# EAGLE design BatmanDetector (EAGLE 7.5.0)
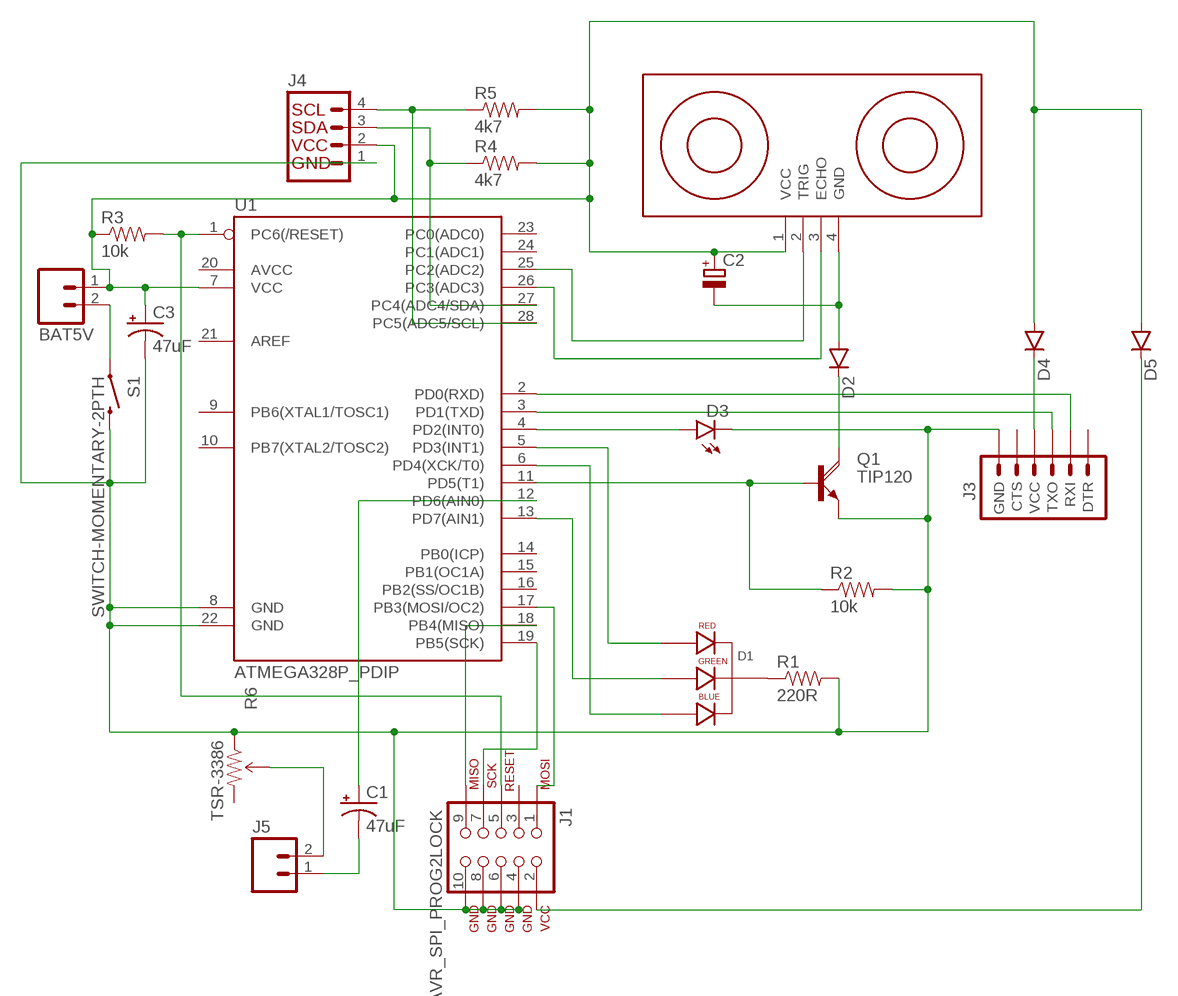
[diagram p0: schematic, sheet 1]

## Parts
BAT5V  M02JST-PTH-VERT  [JST-2-PTH-VERT]
C1  47uF  CAP_POLPTH2  [CPOL-RADIAL-10UF-25V]
C2  CPOL-EUE15-5AXIAL  [E15-5]
C3  47uF  CAP_POLPTH2  [CPOL-RADIAL-10UF-25V]
D1  LED-RGB-CC-THRUDIFFUSE  [LED-RGB-THRU]
D2  DIODE1N4148  [DIODE-1N4148]
D3  LED-3MM-NO_SILK  [LED3MM-NS]
D4  DIODE1N4148  [DIODE-1N4148]
D5  DIODE1N4148  [DIODE-1N4148]
J1  AVR_SPI_PROG2LOCK  [2X5-SHROUDED_LOCK]
J3  ARDUINO_SERIAL_PROGRAMLONGPADS  [1X06_LONGPADS]
J4  I2C_STANDARD_NO_SILK  [1X04_NO_SILK]
J5  M02PTH3  [1X02_LONGPADS]
Q1  TIP120  [TO220AH]
R1  220R  RESISTORAXIAL-0.3  [AXIAL-0.3]
R2  10k  RESISTORAXIAL-0.3  [AXIAL-0.3]
R3  10k  RESISTORAXIAL-0.3  [AXIAL-0.3]
R4  4k7  RESISTORAXIAL-0.3  [AXIAL-0.3]
R5  4k7  RESISTORAXIAL-0.3  [AXIAL-0.3]
R6  TSR-3386  TRIMPOT-PTH-KNOB  [3386U]
S1  SWITCH-MOMENTARY-2PTH  [TACTILE-PTH]
U1  ATMEGA328P_PDIP  [DIL28-3]
U$1  ULTRASONIC-HC-SR04#V  [ULTRASONIC-HC-SR04#V]

## Nets
N$1: D1.1(RED_CATHODE) U1.5(PD3(INT1))
N$2: J1.1(MOSI) U1.17(PB3(MOSI/OC2))
N$3: J1.7(SCK) U1.19(PB5(SCK))
N$4: J3.2(RXI) U1.2(PD0(RXD))
N$5: J3.3(TXO) U1.3(PD1(TXD))
N$6: D3.A U1.4(PD2(INT0))
N$7: Q1.B R2.P$1 U1.11(PD5(T1))
N$8: C2.- D2.A U$1.4(GND)
N$9: D2.C Q1.C
N$10: D1.4(BLUE_CATHODE) U1.6(PD4(XCK/T0))
N$11: D1.3(GREEN_CATHODE) U1.13(PD7(AIN1))
N$12: D1.2(CATHODE) R1.P$1
N$13: U1.25(PC2(ADC2)) U$1.2(TRIG)
N$14: J5.2 R6.2(WIPER)
N$15: J1.5(RESET) R3.P$2 U1.1(PC6(/RESET))
N$16: J4.3 R4.P$1 U1.27(PC4(ADC4/SDA))
N$17: U1.26(PC3(ADC3)) U$1.3(ECHO)
N$19: J4.4 R5.P$1 U1.28(PC5(ADC5/SCL))
N$20: D4.C J3.4(VCC)
N$21: D5.C J1.2(VCC)
N$22: C1.2(-) J5.1
N$23: C1.1(+) U1.12(PD6(AIN0))
N$24: J1.9(MISO) U1.18(PB4(MISO))
N$25: C3.2(-) D3.K(C) J1.4(GND) J1.6(GND) J1.8(GND) J1.10(GND) J3.6(GND) J4.1 Q1.E R1.P$2 R2.P$2 R6.1(CCW) S1.3 U1.8(GND) U1.22(GND)
N$26: BAT5V.2 S1.1
N$27: BAT5V.1 C2.+ C3.1(+) D4.A D5.A J4.2 R3.P$1 R4.P$2 R5.P$2 U1.7(VCC) U$1.1(VCC)
Unconnected: J1.3(NC) J3.1(DTR) J3.5(CTS) R6.3(CW) U1.9(PB6(XTAL1/TOSC1)) U1.10(PB7(XTAL2/TOSC2)) U1.14(PB0(ICP)) U1.15(PB1(OC1A)) U1.16(PB2(SS/OC1B)) U1.20(AVCC) U1.21(AREF) U1.23(PC0(ADC0)) U1.24(PC1(ADC1))

## Library data of the parts
BAT5V J5 = SparkFun-Connectors:M02: Standard 2-pin 0.1" header. Use with - straight break away headers ( PRT-00116) - right angle break away headers (PRT-00553) - swiss pins (PRT-00743) - machine pins (PRT-00117) - female headers (PRT-00115) Molex polarized connector foot print use with: PRT-08233 with associated crimp pins and housings. 2.54_SCREWTERM for use with PRT-10571. 3.5mm Screw Terminal footprints for PRT-08084 5mm Screw Terminal footprints for use with PRT-08432
C1 C3 = SparkFun-Passives:CAP_POL: Capacitor Polarized These are standard SMD and PTH capacitors. Normally 10uF, 47uF, and 100uF in electrolytic and tantalum varieties. Always verify the external diameter of the through hole cap, it varies with capacity, voltage, and manufacturer. The EIA devices should be standard.
C2 = rcl:CPOL-EU: POLARIZED CAPACITOR, European symbol
D1 = SparkFun-LED:LED-RGB-CC-THRU: RGB Through-hole common cathode LED SparkFun Storefront: COM-00105 (Clear) COM-09264 (Diffuse); PROD_ID: DIO-09434
D2 D4 D5 = SparkFun-DiscreteSemi:DIODE: Diode These are standard reverse protection diodes and small signal diodes. SMA package can handle up to about 1A. SOD-323 can handle about 200mA. What the SOD-323 package when ordering, there are some mfgs out there that are 5-pin packages.
D3 = SparkFun-LED:LED: LEDs Standard schematic elements and footprints for 5mm, 3mm, 1206, and 0603 sized LEDs. 5mm - Spark Fun Electronics SKU : COM-00529 (and others)
J1 = SparkFun-Connectors:AVR_SPI_PROG2: AVR 10-pin ICSP Header This is the standard AVR In Circuit Serial Programming header. Minimal, but includes pin one indicator. Works with standard Olimex programmers. Also look for the 6-pin reduced version. Spark Fun Electronics SKU: PRT-00778
J3 = SparkFun-Connectors:ARDUINO_SERIAL_PROGRAM: FTDI connector footprints
J4 = SparkFun-Connectors:I2C_STANDARD: SparkFun has standardized on a pinout for all I2C based sensor breakouts. This pinout allows I2C boards to be plugged directly into the headers on Arduino Uno compatible boards, and to be daisy chained easily.
Q1 = transistor-power:TIP120: NPN DARLINGTON TRANSISTOR
R1-R5 = SparkFun-Passives:RESISTOR: Resistor Basic schematic elements and footprints for 0603, 1206, and PTH resistors.
R6 = SparkFun-Electromechanical:TRIMPOT: Various small potentiometers for "set-and-forget" applications; PROD_ID: RES-09730
S1 = SparkFun-Electromechanical:SWITCH-MOMENTARY-2: Various NO switches- pushbuttons, reed, etc; PROD_ID: SWCH-08441
U1 = SparkFun-DigitalIC:ATMEGA328P_PDIP: uC used in the Arduino 32kb flash, 1k EEPROM, 2k SRAM This is the through-hole version of this chip.
U$1 = diy-modules:ULTRASONIC-HC-SR04: Ultrasonic Ranging Module HC-SR04

## Board
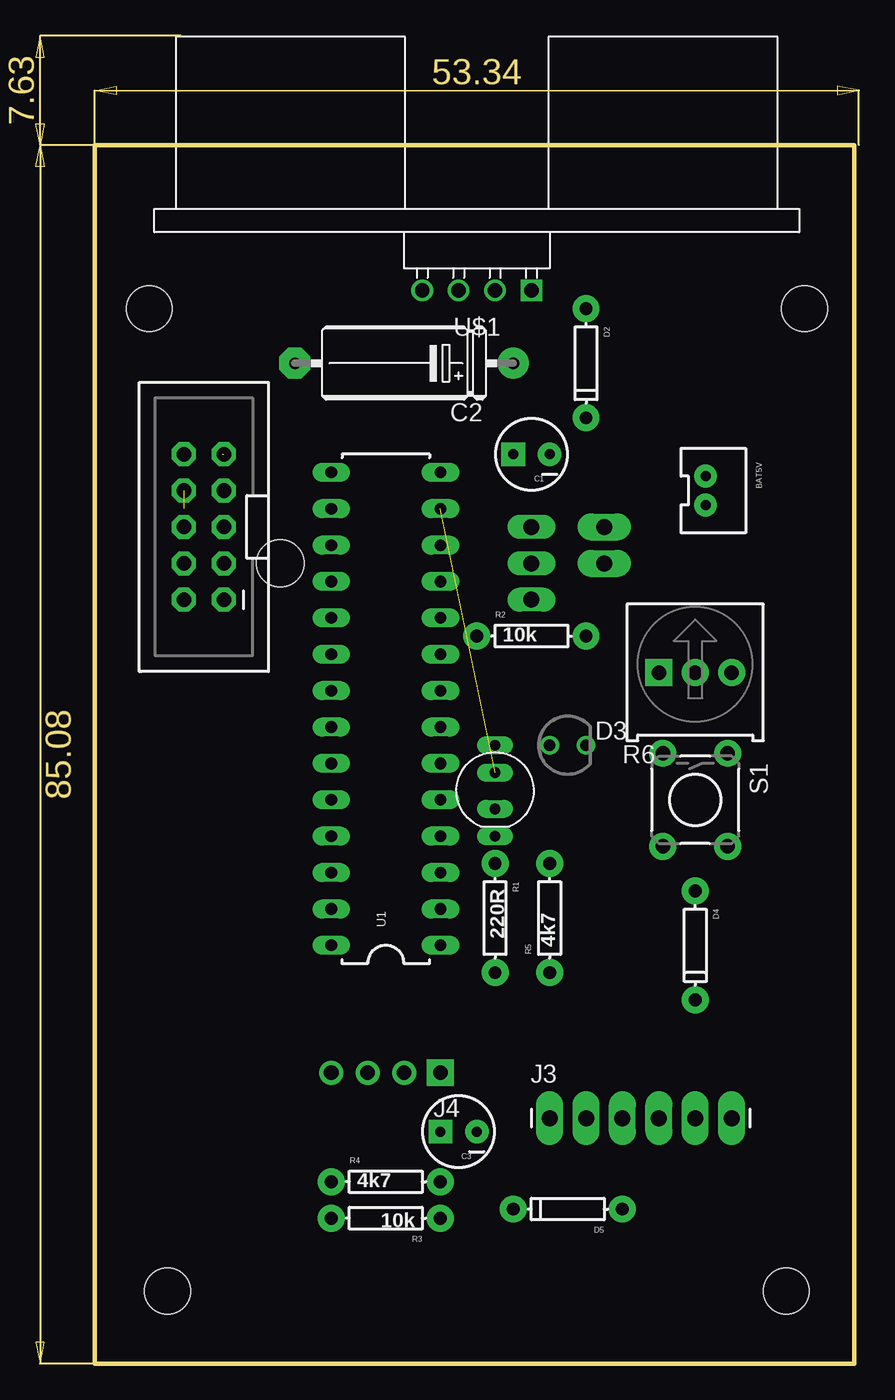
[diagram p1: board, top side]
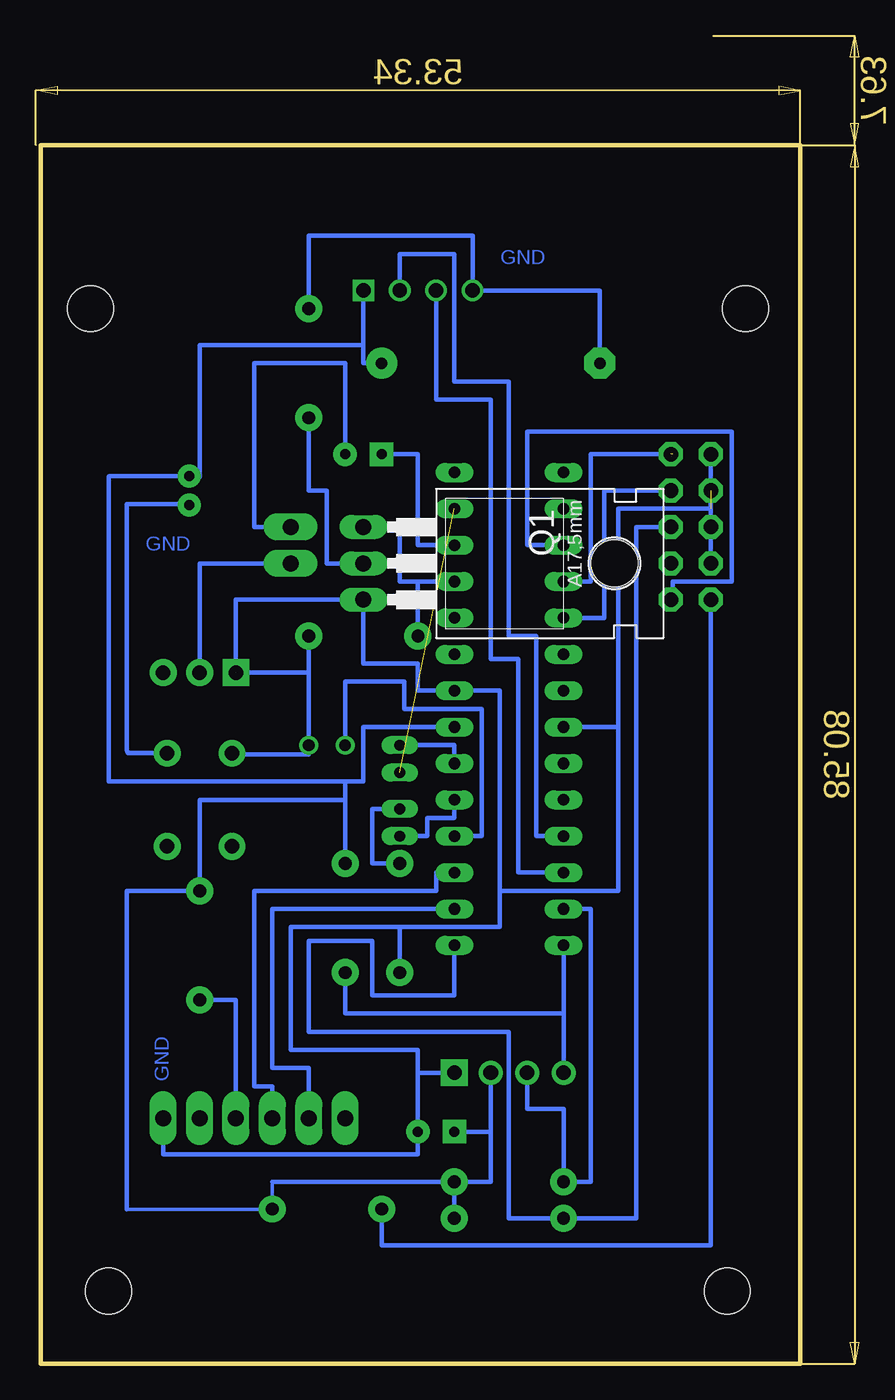
[diagram p2: board, bottom side, seen from below]

Size 53.01 x 85.08 mm. Coordinates in mm from the lower left corner, seen from the top.
Outline: 0,0 53.01,0 53.01,85.08 0,85.08 0,0
Copper layers (1*16): Top 0.035mm / dielectric 1.5mm / Bottom 0.035mm
Design rules "default": minimum track width 10mil, minimum drill 24mil, track to track 8mil, track to pad 8mil, pad to pad 8mil, via to via 8mil, smd to smd 8mil, copper to edge 40mil, drill to drill 8mil, minimum pad ring 10mil, minimum via ring 8mil, stop-mask expansion 4mil, vias tented up to drill 0mil, thermal gap 10mil
Holes 3.2 mm at 48.26,5.08 5.08,5.08 3.81,73.66 49.53,73.66

### Footprints (pad centres in the part's own frame; a part is rotated, then mirrored left to right if it is on the bottom)
JST-2-PTH-VERT = drill 0.7 pad 1.6: 1 -1,-0.55; 2 1,-0.55
CPOL-RADIAL-10UF-25V = drill 0.7 pad 1.651 square: 1 1.27,0 | drill 0.7 pad 1.651: 2 -1.27,0
E15-5 = drill 0.813 pad 2.159: + -7.62,0 | drill 0.813 pad 2.159 octagon: - 7.62,0
LED-RGB-THRU = drill 0.762 pad 0.889 long: 1 3.175,0; 2 1.27,0; 3 -1.27,0; 4 -3.175,0
DIODE-1N4148 = drill 0.9 pad 1.88: A -3.81,0; C 3.81,0
LED3MM-NS = drill 0.813: A -1.27,0; K 1.27,0
2X5-SHROUDED_LOCK = drill 1.016 pad 1.676 octagon: 1 -1.397,5.08; 2 1.397,5.08; 3 -1.397,2.54; 4 1.397,2.54; 5 -1.397,0; 6 1.397,0; 7 -1.397,-2.54; 8 1.397,-2.54; 9 -1.397,-5.08; 10 1.397,-5.08
1X06_LONGPADS = drill 1.118 pad 1.88 long: 1 0,0; 2 2.54,0; 3 5.08,0; 4 7.62,0; 5 10.16,0; 6 12.7,0
1X04_NO_SILK = drill 1.016 pad 1.88 square: 1 0,0 | drill 1.016 pad 1.676: 2 2.54,0; 3 5.08,0; 4 7.62,0
1X02_LONGPADS = drill 1.118 pad 1.88 long: 1 0,0; 2 2.54,0
TO220AH = drill 1.118 long: B -2.54,-6.35; C 0,-6.35; E 2.54,-6.35 | hole 3.302: 0,11.176
AXIAL-0.3 = drill 0.9 pad 1.88: P$1 -3.81,0; P$2 3.81,0
3386U = drill 1.016 pad 1.88 square: 1 -2.54,-0.015 | drill 1.016 pad 1.88: 2 0,-0.015; 3 2.54,-0.015
TACTILE-PTH = drill 1.016 pad 1.88: 1 -3.251,2.261; 2 3.251,2.261; 3 -3.251,-2.261; 4 3.251,-2.261
DIL28-3 = drill 0.813 long: 1 -16.51,-3.81; 2 -13.97,-3.81; 3 -11.43,-3.81; 4 -8.89,-3.81; 5 -6.35,-3.81; 6 -3.81,-3.81; 7 -1.27,-3.81; 8 1.27,-3.81; 9 3.81,-3.81; 10 6.35,-3.81; 11 8.89,-3.81; 12 11.43,-3.81; 13 13.97,-3.81; 14 16.51,-3.81; 15 16.51,3.81; 16 13.97,3.81; 17 11.43,3.81; 18 8.89,3.81; 19 6.35,3.81; 20 3.81,3.81; 21 1.27,3.81; 22 -1.27,3.81; 23 -3.81,3.81; 24 -6.35,3.81; 25 -8.89,3.81; 26 -11.43,3.81; 27 -13.97,3.81; 28 -16.51,3.81
ULTRASONIC-HC-SR04#V = drill 1 square: 1 -3.81,0 | drill 1: 2 -1.27,0; 3 1.27,0; 4 3.81,0

### Placement (x,y rotation side)
BAT5V  43.18,60.96 270 top
C1  30.48,63.5 180 top
C2  21.59,69.85 180 top
C3  25.4,16.19 180 top
D1  27.94,40.01 270 top
D2  34.29,69.85 270 top
D3  33.02,43.18 0 top
D4  41.91,29.21 270 top
D5  33.02,10.8 180 top
J1  7.62,58.42 180 top
J3  31.75,17.14 0 top
J4  24.13,20.32 180 top
J5  35.56,58.42 270 top
Q1  24.13,55.88 270 bottom
R1  27.94,31.12 270 top
R2  30.48,50.8 0 top
R3  20.32,10.16 180 top
R4  20.32,12.7 0 top
R5  31.75,31.12 90 top
R6  41.91,48.26 0 top
S1  41.91,39.37 270 top
U1  20.32,45.72 90 top
U$1  26.67,74.93 180 top

### Tracks (layer width: path | path; a pad name or v marks a point on that pad's centre or on a via)
N$1
  Bottom 0.305: U1.5 24.13,38.1 26.04,38.1 26.04,36.83 D1.1
N$2
  Bottom 0.305: U1.17 19.05,57.15 19.05,65.09 4.76,65.09 4.76,54.61 8.89,54.61 8.89,53.34 J1.1
N$3
  Bottom 0.305: U1.19 13.65,52.07 13.65,60.96 J1.7
N$4
  Bottom 0.305: U1.2 36.83,31.75 36.83,20.64 34.29,20.64 J3.2
N$5
  Bottom 0.305: U1.3 25.4,34.29 25.4,33.02 38.1,33.02 38.1,19.37 36.83,19.37 J3.3
N$6
  Bottom 0.305: D3.A 31.75,47.62 27.62,47.62 27.62,45.72 22.23,45.72 22.23,36.83 U1.4
N$7
  Bottom 0.305: U1.11 26.67,54.61 | 26.67,54.61 27.94,54.61 27.94,58.42 Q1.B | R2.P$1 26.67,54.61
N$8
  Bottom 0.305: D2.A 34.29,78.74 22.86,78.74 U$1.4 13.97,74.93 C2.-
N$9
  Bottom 0.305: Q1.C 33.02,55.88 33.02,60.96 34.29,60.96 D2.C
N$10
  Bottom 0.305: U1.6 24.13,43.18 D1.4
N$11  (1 unrouted)
N$12
  Bottom 0.305: D1.2 29.85,38.73 29.85,34.93 R1.P$1
N$13
  Bottom 0.305: U$1.2 27.94,77.47 24.13,77.47 24.13,68.58 20.32,68.58 20.32,50.8 18.41,50.8 18.41,36.83 U1.25
N$14
  Bottom 0.305: J5.2 41.91,55.88 R6.2
N$15
  Bottom 0.305: U1.1 24.13,25.72 29.85,25.72 29.85,29.53 34.29,29.53 34.29,23.18 20.32,23.18 20.32,10.16 R3.P$2 11.43,10.16 11.43,58.42 J1.5
N$16
  Bottom 0.305: J4.3 19.05,17.78 16.51,17.78 R4.P$1 14.6,12.7 14.6,31.75 U1.27
N$17
  Bottom 0.305: U1.26 19.69,34.29 19.69,49.21 21.59,49.21 21.59,67.31 25.4,67.31 U$1.3
N$19
  Bottom 0.305: J4.4 16.51,24.45 | U1.28 16.51,24.45 | 16.51,24.45 31.75,24.45 R5.P$1
N$20
  Bottom 0.305: J3.4 39.37,25.4 D4.C
N$21
  Bottom 0.305: D5.C 29.21,8.25 6.22,8.25 J1.2
N$22
  Bottom 0.305: J5.1 38.1,58.42 38.1,69.85 31.75,69.85 C1.2
N$23
  Bottom 0.305: U1.12 26.67,57.15 26.67,63.5 C1.1
N$24  (1 unrouted)
  Bottom 0.305: U1.18 14.6,54.61 14.6,63.5 8.89,63.5
N$25  (2 unrouted)
  Bottom 0.305: U1.22 12.7,44.45 | 12.7,44.45 12.7,33.02 20.96,33.02 | 20.96,33.02 20.96,46.99 U1.8 26.67,46.99 26.67,48.9 30.48,48.9 Q1.E 39.37,53.34 39.37,48.26 | 34.29,48.24 D3.K 34.29,42.55 39.69,42.55 39.69,42.62 S1.3 | 34.29,48.24 R6.1 | R2.P$2 34.29,48.24 | J3.6 44.45,14.61 26.67,14.61 C3.2 26.67,20.32 | J4.1 26.67,20.32 | J1.10 6.22,59.69 | 6.22,59.69 J1.6 J1.4 | 27.94,30.48 35.56,30.48 35.56,21.91 26.67,21.91 26.67,20.32 | 20.96,33.02 20.96,30.48 27.94,30.48 | 27.94,30.48 R1.P$2 | 12.7,44.45 12.7,59.69 6.22,59.69
N$26
  Bottom 0.305: S1.1 46.91,42.62 46.99,42.86 46.99,60.01 42.68,60.01 BAT5V.2
N$27
  Bottom 0.254: 46.99,10.8 D5.A 36.83,12.7
  Bottom 0.305: 30.48,71.12 41.91,71.12 41.91,61.91 42.58,61.91 BAT5V.1 48.21,61.96 48.26,61.91 48.26,40.64 31.75,40.64 | 31.75,40.64 30.48,40.64 30.48,44.45 U1.7 | 46.99,10.8 46.99,33.02 D4.A 41.91,39.37 31.75,39.37 | 36.83,12.7 R4.P$2 | R4.P$2 R3.P$1 | 31.75,39.37 31.75,40.64 | R5.P$2 31.75,39.37 | U$1.1 30.48,71.12 | 30.48,71.12 30.48,69.85 C2.+ | 21.59,16.19 21.59,12.7 R4.P$2 | C3.1 21.59,16.19 | 21.59,16.19 J4.2

### Text on the board
Bottom: GND | GND | GND